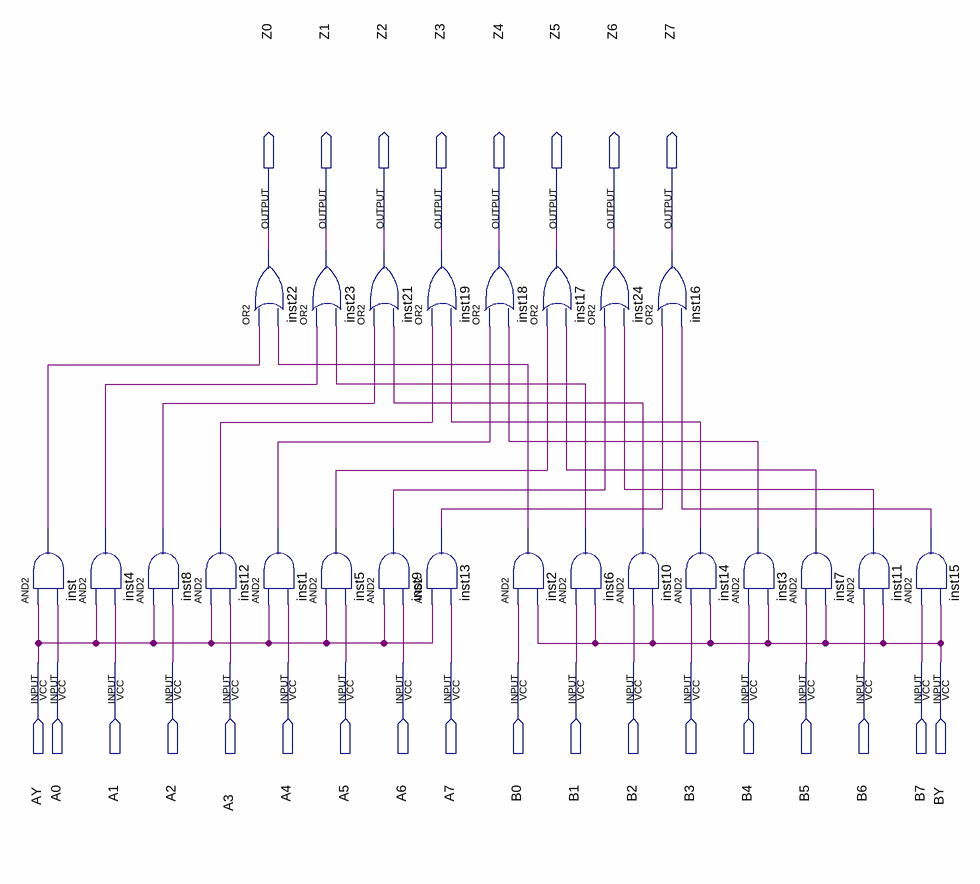
[diagram p0: schematic sheet]
// Quartus schematic chooser_8.bdf as structural Verilog: 24 symbols, 26 pins
module chooser_8 (
  input  AY,
  input  A0,
  input  A1,
  input  A2,
  input  A3,
  input  A4,
  input  A5,
  input  A6,
  input  A7,
  input  B0,
  input  B1,
  input  B2,
  input  B3,
  input  B4,
  input  B5,
  input  B6,
  input  B7,
  input  BY,
  output Z0,
  output Z1,
  output Z2,
  output Z3,
  output Z4,
  output Z5,
  output Z6,
  output Z7
);

  wire inst1_out, inst2_out, inst3_out, inst4_out, inst5_out, inst6_out, inst7_out, inst8_out, inst9_out,
       inst10_out, inst11_out, inst12_out, inst13_out, inst14_out, inst15_out, inst_out;

  and inst (inst_out, AY, A0);
  and inst4 (inst4_out, AY, A1);
  and inst8 (inst8_out, AY, A2);
  or inst22 (Z0, inst_out, inst2_out);
  and inst1 (inst1_out, AY, A4);
  and inst12 (inst12_out, AY, A3);
  or inst23 (Z1, inst4_out, inst6_out);
  and inst5 (inst5_out, AY, A5);
  or inst21 (Z2, inst8_out, inst10_out);
  and inst9 (inst9_out, AY, A6);
  or inst18 (Z4, inst1_out, inst3_out);
  or inst19 (Z3, inst12_out, inst14_out);
  and inst13 (inst13_out, AY, A7);
  or inst17 (Z5, inst5_out, inst7_out);
  and inst2 (inst2_out, B0, BY);
  and inst6 (inst6_out, B1, BY);
  or inst24 (Z6, inst9_out, inst11_out);
  and inst10 (inst10_out, B2, BY);
  or inst16 (Z7, inst13_out, inst15_out);
  and inst14 (inst14_out, B3, BY);
  and inst3 (inst3_out, B4, BY);
  and inst7 (inst7_out, B5, BY);
  and inst11 (inst11_out, B6, BY);
  and inst15 (inst15_out, B7, BY);
endmodule
